# EAGLE design BT-USB (EAGLE 7.4.0)
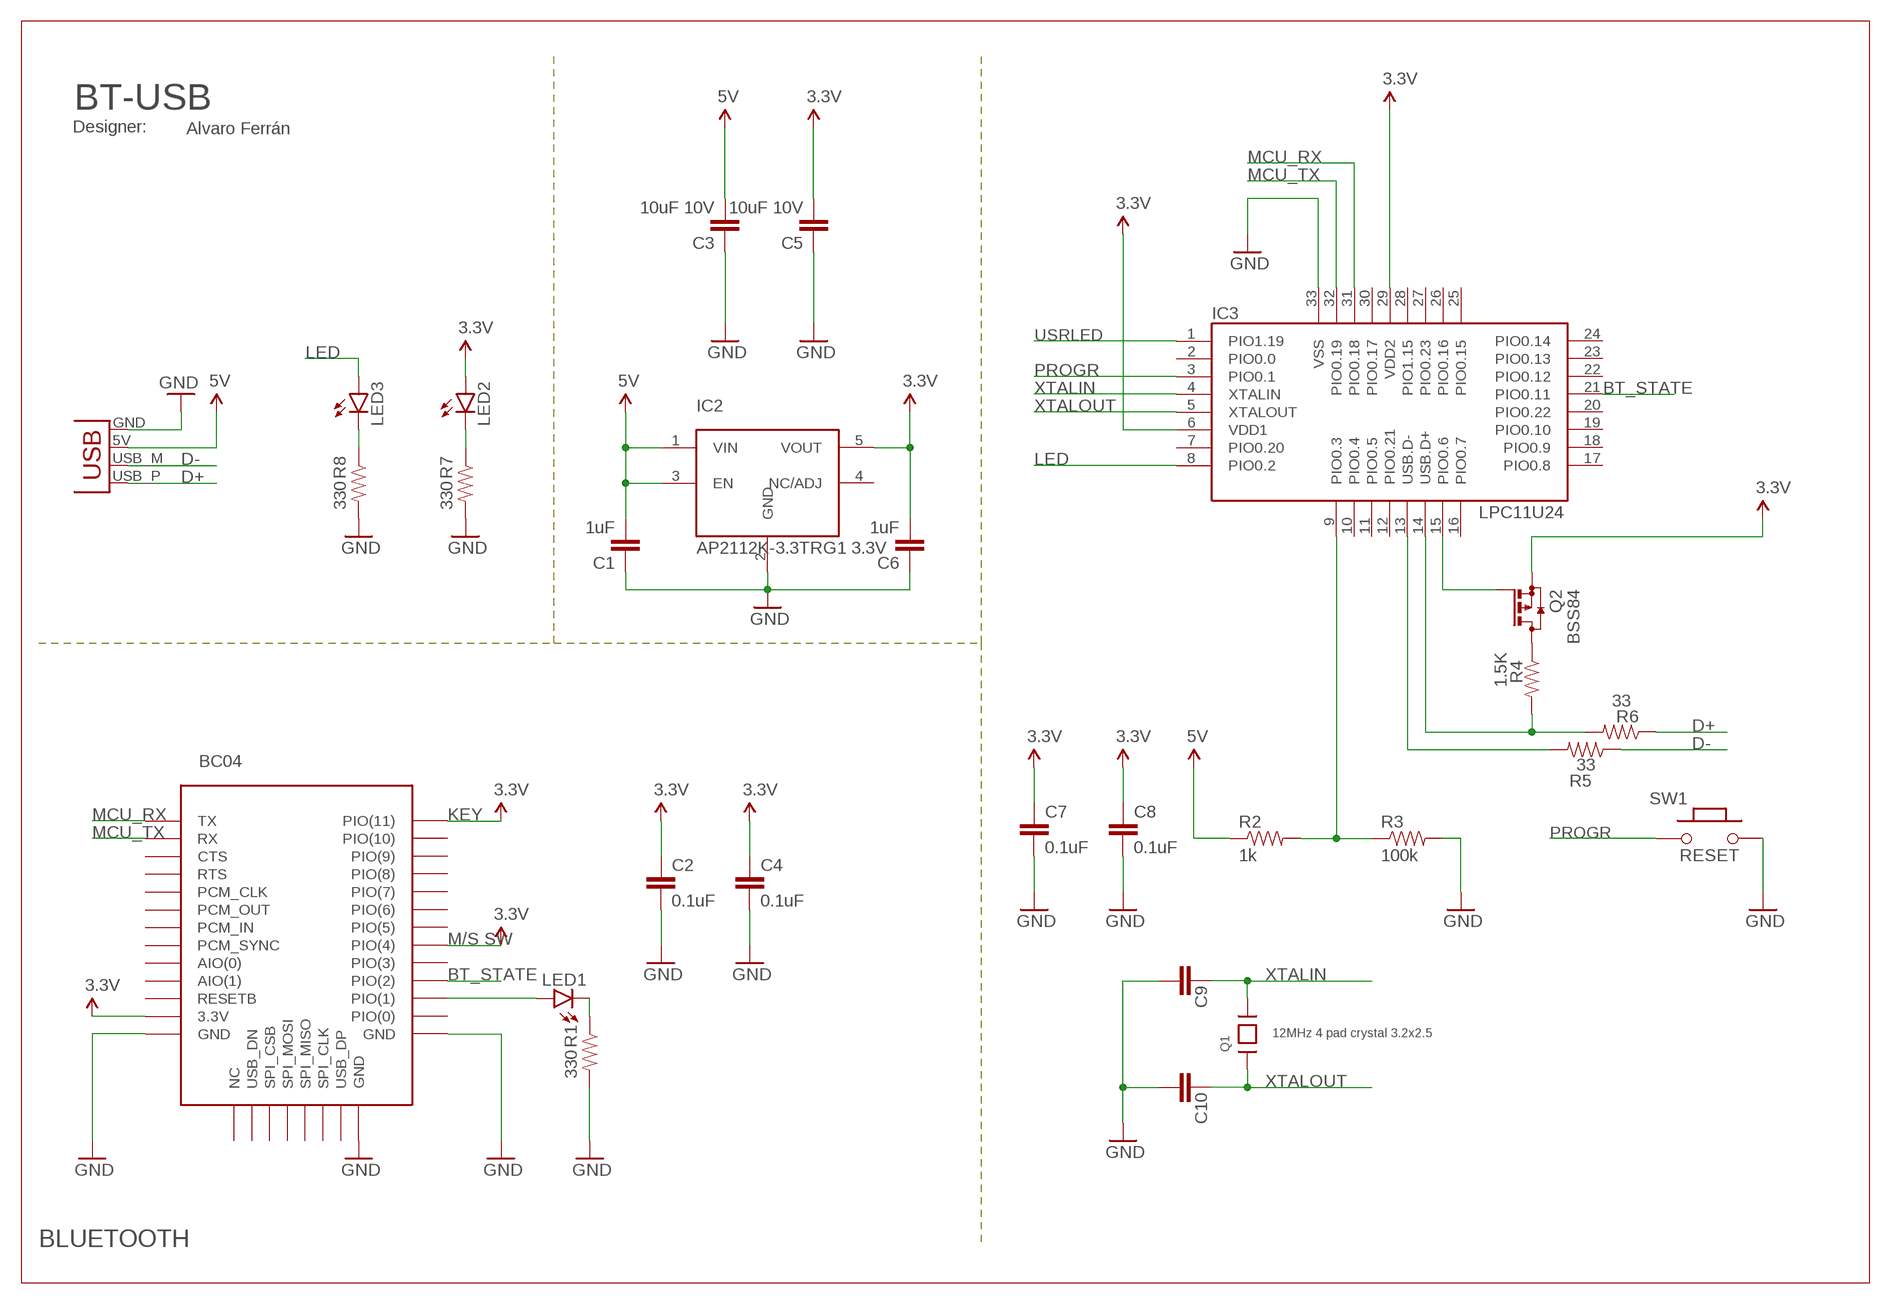
[diagram p0: schematic, sheet 1]

## Parts
C1  1uF  CAP0402-CAP  [0402-CAP]
C2  0.1uF  CAP0402-CAP  [0402-CAP]
C3  10uF 10V  CAP0402-CAP  [0402-CAP]
C4  0.1uF  CAP0402-CAP  [0402-CAP]
C5  10uF 10V  CAP0402-CAP  [0402-CAP]
C6  1uF  CAP0402-CAP  [0402-CAP]
C7  0.1uF  CAP0402-CAP  [0402-CAP]
C8  0.1uF  CAP0402-CAP  [0402-CAP]
C9  27pF  CAP0402-CAP  [0402-CAP]
C10  27pF  CAP0402-CAP  [0402-CAP]
IC1  BC04_BLUETOOTH  [BC04]
IC2  AP2112K-3.3TRG1 3.3V  5PIN_REG  [SOT23-5]
IC3  LPC11U24  LPC11U2X_HVQFN33(5X5)  [HVQFN33_5X5MM]
J1  USBPCB  [USB-A-PCB]
LED1  LED0603  [LED-0603]
LED2  LED0603  [LED-0603]
LED3  LED0603  [LED-0603]
Q1  12MHz 4 pad crystal 3.2x2.5  CRYSTAL3.2X2.5  [CRYSTAL_3.2X2.5]
Q2  BSS84  [SOT23]
R1  330  RESISTOR0402-RES  [0402-RES]
R2  1k  RESISTOR0402-RES  [0402-RES]
R3  100k  RESISTOR0402-RES  [0402-RES]
R4  1.5K  RESISTOR0402-RES  [0402-RES]
R5  33  RESISTOR0402-RES  [0402-RES]
R6  33  RESISTOR0402-RES  [0402-RES]
R7  330  RESISTOR0402-RES  [0402-RES]
R8  330  RESISTOR0402-RES  [0402-RES]
SW1  RESET  PB157  [157SW]

## Nets
3.3V: C2.1 C4.1 C5.2 C6.2 C7.1 C8.1 IC1.P$12(3.3V) IC1.P$27(PIO(4)) IC1.P$34(PIO(11)) IC2.5(VOUT) IC3.6(VDD1) IC3.29(VDD2) LED2.A Q2.2(S)
5V: C1.2 C3.2 IC2.1(VIN) IC2.3(EN) J1.5V(VBUS) R2.1
BT_STATE: IC1.P$25(PIO(2)) IC3.21(PIO0.11)
D+: J1.USB_P(D+) R6.1
D-: J1.USB_M(D-) R5.1
GND: C1.1 C2.2 C3.1 C4.2 C5.1 C6.1 C7.2 C8.2 C9.2 C10.2 IC1.P$13(GND) IC1.P$21(GND) IC1.P$22(GND) IC2.2(GND) IC3.33(VSS) J1.GND R1.2 R3.2 R7.2 R8.2 SW1.2
LED: IC3.8(PIO0.2) LED3.A
MCU_RX: IC1.P$1(TX) IC3.31(PIO0.18)
MCU_TX: IC1.P$2(RX) IC3.32(PIO0.19)
N$1: IC1.P$24(PIO(1)) LED1.A
N$2: LED2.C R7.1
N$3: LED3.C R8.1
N$11: LED1.C R1.1
N$27: IC3.14(USB.D+) R4.2 R6.2
N$29: IC3.13(USB.D-) R5.2
N$30: Q2.3(D) R4.1
N$31: IC3.15(PIO0.6) Q2.1(G)
P0.3/ISP_COMMAND_USB_HIGH: IC3.9(PIO0.3) R2.2 R3.1
PROGR: IC3.3(PIO0.1) SW1.1
USRLED: IC3.1(PIO1.19)
XTALIN: C9.1 IC3.4(XTALIN) Q1.3
XTALOUT: C10.1 IC3.5(XTALOUT) Q1.1
Unconnected: IC1.P$3(CTS) IC1.P$4(RTS) IC1.P$5(PCM_CLK) IC1.P$6(PCM_OUT) IC1.P$7(PCM_IN) IC1.P$8(PCM_SYNC) IC1.P$9(AIO(0)) IC1.P$10(AIO(1)) IC1.P$11(RESETB) IC1.P$14(NC) IC1.P$15(USB_DN) IC1.P$16(SPI_CSB) IC1.P$17(SPI_MOSI) IC1.P$18(SPI_MISO) IC1.P$19(SPI_CLK) IC1.P$20(USB_DP) IC1.P$23(PIO(0)) IC1.P$26(PIO(3)) IC1.P$28(PIO(5)) IC1.P$29(PIO(6)) IC1.P$30(PIO(7)) IC1.P$31(PIO(8)) IC1.P$32(PIO(9)) IC1.P$33(PIO(10)) IC2.4(NC/ADJ) IC3.2(PIO0.0) IC3.7(PIO0.20) IC3.10(PIO0.4) IC3.11(PIO0.5) IC3.12(PIO0.21) IC3.16(PIO0.7) IC3.17(PIO0.8) IC3.18(PIO0.9) IC3.19(PIO0.10) IC3.20(PIO0.22) IC3.22(PIO0.12) IC3.23(PIO0.13) IC3.24(PIO0.14) IC3.25(PIO0.15) IC3.26(PIO0.16) IC3.27(PIO0.23) IC3.28(PIO1.15) IC3.30(PIO0.17)

## Notes on the sheet
- BT-USB
- Designer: | Alvaro Ferrán
- BC04
- KEY
- M/S SW
- BLUETOOTH

## Library data of the parts
C1-C10 = SparkFun-Passives:CAP: Capacitor Standard 0603 ceramic capacitor, and 0.1" leaded capacitor.
IC1 = bc04:BC04_BLUETOOTH; IC: BC04
IC2 = GHI:5PIN_REG
IC3 = GHI-SoMs-Processors:LPC11U2X_HVQFN33(5X5)
J1 = SparkFun-Connectors:USB: USB Connectors USB-B-PTH is fully proven SKU : PRT-00139/CONN-08278 USB-miniB is fully proven SKU : PRT-00587 USB-A-PCB is untested. USB-A-H is throughly reviewed, but untested. Spark Fun Electronics SKU : PRT-00437 USB-B-SMT is throughly reviewed, but untested. Needs silkscreen touching up. USB-A-S has not been used/tested USB-MB-H has not been used/tested USB-MICROB has been used. CONN-09505
LED1-LED3 = SparkFun-LED:LED: LEDs Standard schematic elements and footprints for 5mm, 3mm, 1206, and 0603 sized LEDs. 5mm - Spark Fun Electronics SKU : COM-00529 (and others)
Q1 = GHI:CRYSTAL3.2X2.5
Q2 = transistor-small-signal:BSS84: P-CHANNEL MOS FET
R1-R8 = SparkFun-Passives:RESISTOR: Resistor Basic schematic elements and footprints for 0603, 1206, and PTH resistors.
SW1 = MySMD:PB157

## Net classes
0 default: width 0.254 mm, drill 0.254 mm, clearance 0.203 mm

## Board
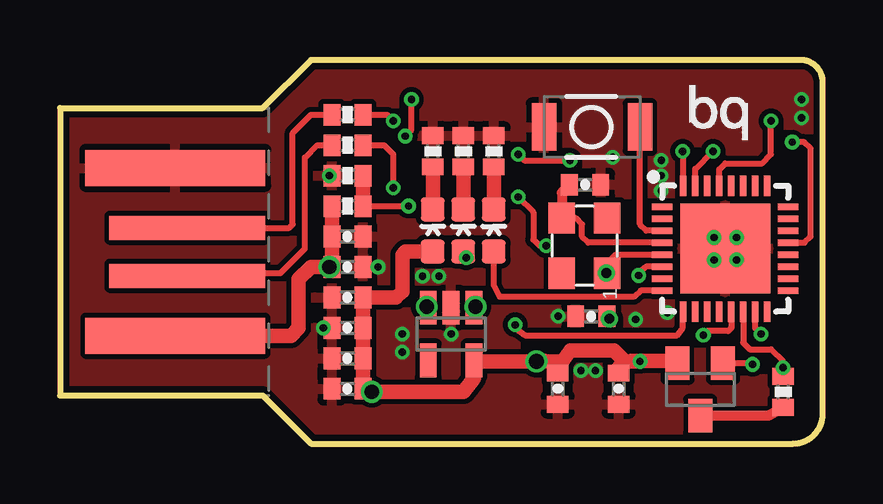
[diagram p1: board, top side]
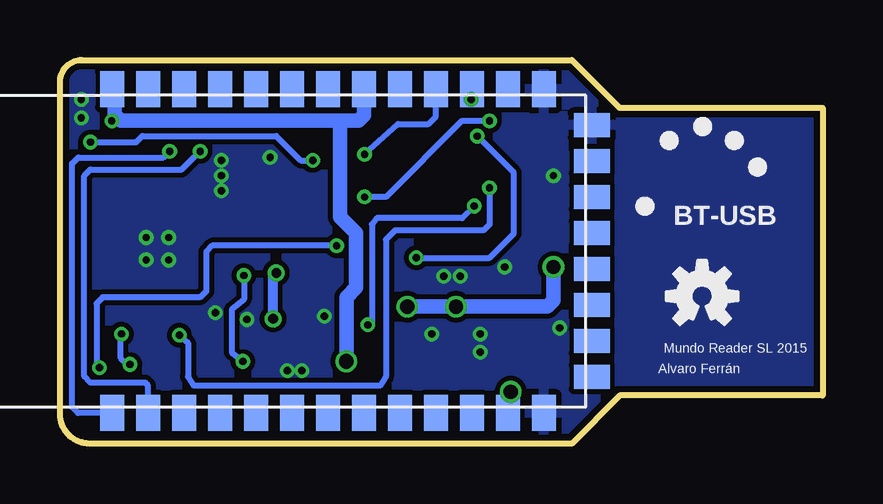
[diagram p2: board, bottom side, seen from below]

Size 31.8 x 16 mm. Coordinates in mm from the lower left corner, seen from the top.
Outline: 10.46,0 30.56,0 arc90 31.8,1.24 31.8,15.08 arc90 30.88,16 10.46,16 8.46,14 0,14 0,2.01 8.46,2.01 10.46,0
Copper layers (1*16): Top 0.035mm / dielectric 1.5mm / Bottom 0.035mm
Design rules "pighixxx_CAM_DRC_V1.0": minimum track width 6mil, minimum drill 12mil, track to track 6mil, track to pad 6mil, pad to pad 6mil, via to via 6mil, smd to smd 0mil, copper to edge 10mil, drill to drill 10mil, minimum pad ring 10mil, minimum via ring 6mil, stop-mask expansion 2mil, vias tented up to drill 100mil, thermal gap 10mil

### Footprints (pad centres in the part's own frame; a part is rotated, then mirrored left to right if it is on the bottom)
0402-CAP = smd 0.7 x 0.9: 1 -0.65,0; 2 0.65,0
BC04 = smd 1 x 1.5: P$1 7,-0.25; P$2 8.5,-0.25; P$3 10,-0.25; P$4 11.5,-0.25; P$5 13,-0.25; P$6 14.5,-0.25; P$7 16,-0.25; P$8 17.5,-0.25; P$9 19,-0.25; P$10 20.5,-0.25; P$11 22,-0.25; P$12 23.5,-0.25; P$13 25,-0.25; P$22 25,13.25; P$23 23.5,13.25; P$24 22,13.25; P$25 20.5,13.25; P$26 19,13.25; P$27 17.5,13.25; P$28 16,13.25; P$29 14.5,13.25; P$30 13,13.25; P$31 11.5,13.25; P$32 10,13.25; P$33 8.5,13.25; P$34 7,13.25 | smd 1.5 x 1: P$14 27,1.25; P$15 27,2.75; P$16 27,4.25; P$17 27,5.75; P$18 27,7.25; P$19 27,8.75; P$20 27,10.25; P$21 27,11.75
SOT23-5 = smd 0.7 x 1.4: 1 0.95,1.1; 2 0,1.1; 3 -0.95,1.1; 4 -0.95,-1.1; 5 0.95,-1.1
HVQFN33_5X5MM = smd 0.85 x 0.27: 1 -2.625,1.75; 2 -2.625,1.25; 3 -2.625,0.75; 4 -2.625,0.25; 5 -2.625,-0.25; 6 -2.625,-0.75; 7 -2.625,-1.25; 8 -2.625,-1.75; 17 2.625,-1.75; 18 2.625,-1.25; 19 2.625,-0.75; 20 2.625,-0.25; 21 2.625,0.25; 22 2.625,0.75; 23 2.625,1.25; 24 2.625,1.75 | smd 0.27 x 0.85: 9 -1.75,-2.625; 10 -1.25,-2.625; 11 -0.75,-2.625; 12 -0.25,-2.625; 13 0.25,-2.625; 14 0.75,-2.625; 15 1.25,-2.625; 16 1.75,-2.625; 25 1.75,2.625; 26 1.25,2.625; 27 0.75,2.625; 28 0.25,2.625; 29 -0.25,2.625; 30 -0.75,2.625; 31 -1.25,2.625; 32 -1.75,2.625 | smd 3.75 x 3.75: 33 0,0
USB-A-PCB = smd 7.5 x 1.5: 5V -0.2,-3.5; GND -0.2,3.5 | smd 6.5 x 1: USB_M 0.3,-1; USB_P 0.3,1
LED-0603 = smd 1 x 1: A 0,-0.877; C 0,0.877
CRYSTAL_3.2X2.5 = smd 1.3 x 1.1: 1 -1.1,-0.9; 2 1.2,-0.9; 3 1.2,1; 4 -1.1,1
SOT23 = smd 1 x 1.4: 1 -0.95,-1.1; 2 0.95,-1.1; 3 0,1.1
0402-RES = smd 0.7 x 0.9: 1 -0.65,0; 2 0.65,0
157SW = smd 1.016 x 1.981: 1 0,0; 2 4,0

### Placement (x,y rotation side)
C1  11.99,7.37 180 top
C2  11.99,3.56 180 top
C3  11.99,8.64 180 top
C4  11.99,2.29 180 top
C5  11.99,4.83 0 top
C6  11.99,6.1 0 top
C7  20.75,2.29 270 top
C8  23.29,2.29 270 top
C9  21.89,10.8 0 top
C10  22.15,5.31 180 top
IC1  36.63,1.52 0 bottom
IC2  16.31,4.57 0 top
IC3  27.74,8.13 0 top
J1  5,8 0 top
LED1  16.81,8.89 0 top
LED2  15.54,8.89 0 top
LED3  18.08,8.89 0 top
Q1  21.92,8.2 90 top
Q2  26.7,2.26 180 top
R1  16.81,12.19 90 top
R2  11.99,9.91 0 top
R3  11.99,11.18 180 top
R4  30.15,2.16 90 top
R5  11.99,12.45 0 top
R6  11.99,13.72 0 top
R7  15.54,12.19 90 top
R8  18.08,12.19 90 top
SW1  24.18,13.21 180 top
U$1  [BQ_LOGO_SMALL_1]  27.43,13.16 0 top
U$2  [BQ_LOGO_SMALL_2]  7.8,9.27 0 bottom
U$3  [OSHW-LOGO-S]  5.03,6.15 0 bottom

### Tracks (layer width: path | path; a pad name or v marks a point on that pad's centre or on a via)
3.3V  (via drill 0.3, 0.6, 0.61)
  Top 0.254: IC3.6 24.45,7.38 24.13,7.14 v24.13,7.01 | IC3.29 27.49,11.43 27.74,11.68 29.26,11.68 29.64,12.07 v29.64,13.46 | v24.18,3.43 23.8,3.44
  Top 0.61: IC2.5 17.26,3.3 | 17.26,3.3 17.26,2.73 16.81,2.16 v13,2.16 C4.1 C2.1 C5.2 C6.2 14.02,6.1 14.27,6.35 14.27,7.87 14.41,8.01 LED2.A | 23.8,3.44 25.66,3.44 Q2.2 | 17.26,3.3 17.4,3.44 17.41,3.43 v19.86,3.43 | v19.86,3.43 20.23,3.44 | 23.55,3.43 23.09,3.89 21.28,3.89 20.95,3.43 20.88,3.43 | 23.55,3.43 v24.18,3.43 | 23.55,3.43 23.29,3.17 C8.1 | C7.1 20.88,3.06 20.88,3.43 | 20.88,3.43 v19.86,3.43
  Bottom 0.254: v29.64,13.46 29.64,14.22 29.51,14.22 | v24.13,7.01 24.13,6.02 24.64,5.59 24.64,3.81 v24.18,3.43
  Bottom 0.61: v13,2.16 13,1.4 IC1.P$12 | 20.12,13.46 19.35,13.46 19.13,13.69 IC1.P$27 | 20.12,13.46 29.26,13.46 29.51,13.72 29.51,14.22 29.51,14.66 IC1.P$34 | 20.12,13.46 20.12,9.45 19.46,8.79 19.46,6.5 19.86,6.1 v19.86,3.43
5V  (via drill 0.6)
  Top 0.61: R2.1 C3.2 C1.2 | J1.5V 9.63,4.5 9.96,4.83 9.96,6.86 10.46,7.37 C1.2 | C1.2 v11.23,7.37 | IC2.1 17.26,5.65 v17.32,5.71 | v15.29,5.71 15.31,5.71 IC2.3 15.36,5.78 v15.29,5.71
  Bottom 0.61: v17.32,5.71 v15.29,5.71 11.48,5.71 11.23,5.97 v11.23,7.37
BT_STATE  (via drill 0.3)
  Top 0.254: IC3.21 31.04,8.38 31.29,8.64 31.29,12.32 31.04,12.57 v30.53,12.57 | v19.1,12.07 19.35,11.81 v21.26,11.81
  Bottom 0.254: v30.53,12.57 28.63,12.57 28.37,12.83 22.78,12.83 21.77,11.81 v21.26,11.81 | v19.1,12.07 17.7,13.34 16.43,13.34 16.13,13.64 IC1.P$25
D+
  Top 0.254: J1.USB_P 9.56,9 9.7,9.14 9.7,12.95 10.46,13.72 R6.1
D-
  Top 0.254: J1.USB_M 5.41,7.11 9.19,7.11 10.21,8.13 10.21,11.94 10.72,12.45 R5.1
GND  (via drill 0.3)
  other vias: 30.91,13.59 23.04,11.94 16.31,4.57 11.23,11.18 14.27,3.81 13.26,7.37 10.97,4.83 27.27,8.6 28.21,8.59 28.21,7.66 20.78,5.31 15.11,6.99 14.27,4.57 15.8,6.99 25.07,11.18 25.07,10.54 25.32,5.46 24,5.18 21.72,3.05 27.27,7.66 22.33,3.05 25.07,11.81 30.91,14.35
  pour Bottom: -1.73,-1.78 33.07,-1.78 33.32,18.03 -1.47,18.03
  pour Top: -1.22,-1.27 33.07,-1.27 33.07,17.53 -1.22,17.53
LED
  Top 0.254: IC3.8 24.21,6.38 23.93,6.12 18.34,6.12 18.08,6.6 LED3.A
MCU_RX  (via drill 0.3)
  Top 0.254: IC3.31 26.49,11.45 v27.23,12.19
  Bottom 0.254: IC1.P$1 31.04,1.27 31.29,1.52 31.29,11.68 31.04,11.94 27.48,11.94 v27.23,12.19
MCU_TX  (via drill 0.3)
  Top 0.254: IC3.32 25.99,12.16 arc90 v25.96,12.19
  Bottom 0.254: IC1.P$2 28.13,2.42 28.24,2.54 30.53,2.54 30.78,2.79 30.78,11.18 30.53,11.43 26.72,11.43 v25.96,12.19
N$1  (via drill 0.3)
  Top 0.254: v14.4,12.83 14.66,13.08 v14.66,14.35
  Top 0.406: LED1.A 16.94,8.01 v16.94,7.75
  Bottom 0.254: v16.94,7.75 13.89,7.75 12.88,8.76 12.88,11.3 v14.4,12.83
  Bottom 0.305: v14.66,14.35 14.63,14.38 IC1.P$24
N$2
  Top 0.61: R7.1 LED2.C
N$3
  Top 0.61: R8.1 LED3.C
N$11
  Top 0.61: R1.1 LED1.C
N$27  (via drill 0.3)
  Top 0.254: IC3.14 28.49,4.2 28.75,3.94 29.64,3.94 30.15,3.43 v30.15,3.17 R4.2 | R6.2 13.64,13.72 v13.89,13.46 | v19.1,10.29 19.74,9.65 19.74,8.51 19.99,8.25 v20.27,8.25
  Bottom 0.254: v20.27,8.25 25.45,8.25 25.7,8 25.7,6.35 25.96,6.1 30.02,6.1 30.28,5.84 30.28,3.3 v30.15,3.17 | v13.89,13.46 15.04,13.46 18.21,10.29 v19.1,10.29
N$29  (via drill 0.3)
  Top 0.254: R5.2 13.51,12.45 13.89,12.07 v13.89,10.67 | IC3.13 27.99,4.83 27.86,4.7 26.97,4.7 v26.82,4.52
  Bottom 0.254: v13.89,10.67 13.89,9.14 14.15,8.89 17.83,8.89 18.21,8.51 18.21,2.79 18.47,2.41 26.21,2.41 26.47,2.79 26.47,4.19 v26.82,4.52
N$30
  Top 0.406: R4.1 29.55,1.16 Q2.3
N$31  (via drill 0.3)
  Top 0.254: v29.24,4.57 28.99,4.82 IC3.15 | Q2.1 28.82,3.36 v28.88,3.3
  Bottom 0.254: v28.88,3.3 29.01,3.3 29.26,3.56 29.26,4.55 v29.24,4.57
P0.3/ISP_COMMAND_USB_HIGH  (via drill 0.3)
  Top 0.254: R2.2 v14.53,9.91 | IC3.9 25.96,5.48 25.96,4.83 25.73,4.52 19.38,4.52 18.97,4.83 v18.97,4.95
  Top 0.61: R3.1 R2.2
  Bottom 0.254: v14.53,9.91 15.04,9.4 18.59,9.4 18.8,9.14 18.8,5.08 18.92,4.95 v18.97,4.95
PROGR
  Top 0.254: IC3.3 24.45,8.88 24.18,9.14 SW1.1
XTALIN
  Top 0.254: IC3.4 22.02,8.38 21.77,8.64 21.77,9.14 21.51,9.4 Q1.3
  Top 0.406: C9.1 20.92,10.47 Q1.3
XTALOUT  (via drill 0.41)
  Top 0.254: IC3.5 23.16,7.87 22.78,7.49 v22.78,7.11
  Top 0.61: C10.1 22.86,5.26 v22.91,5.21 | v22.78,7.11 22.78,7.19 Q1.1
  Bottom 0.406: v22.91,5.21 22.91,6.99 v22.78,7.11

### Text on the board
bPlace: BT-USB | Mundo Reader SL 2015 | Alvaro Ferrán